# EAGLE design power board (EAGLE 5.07)
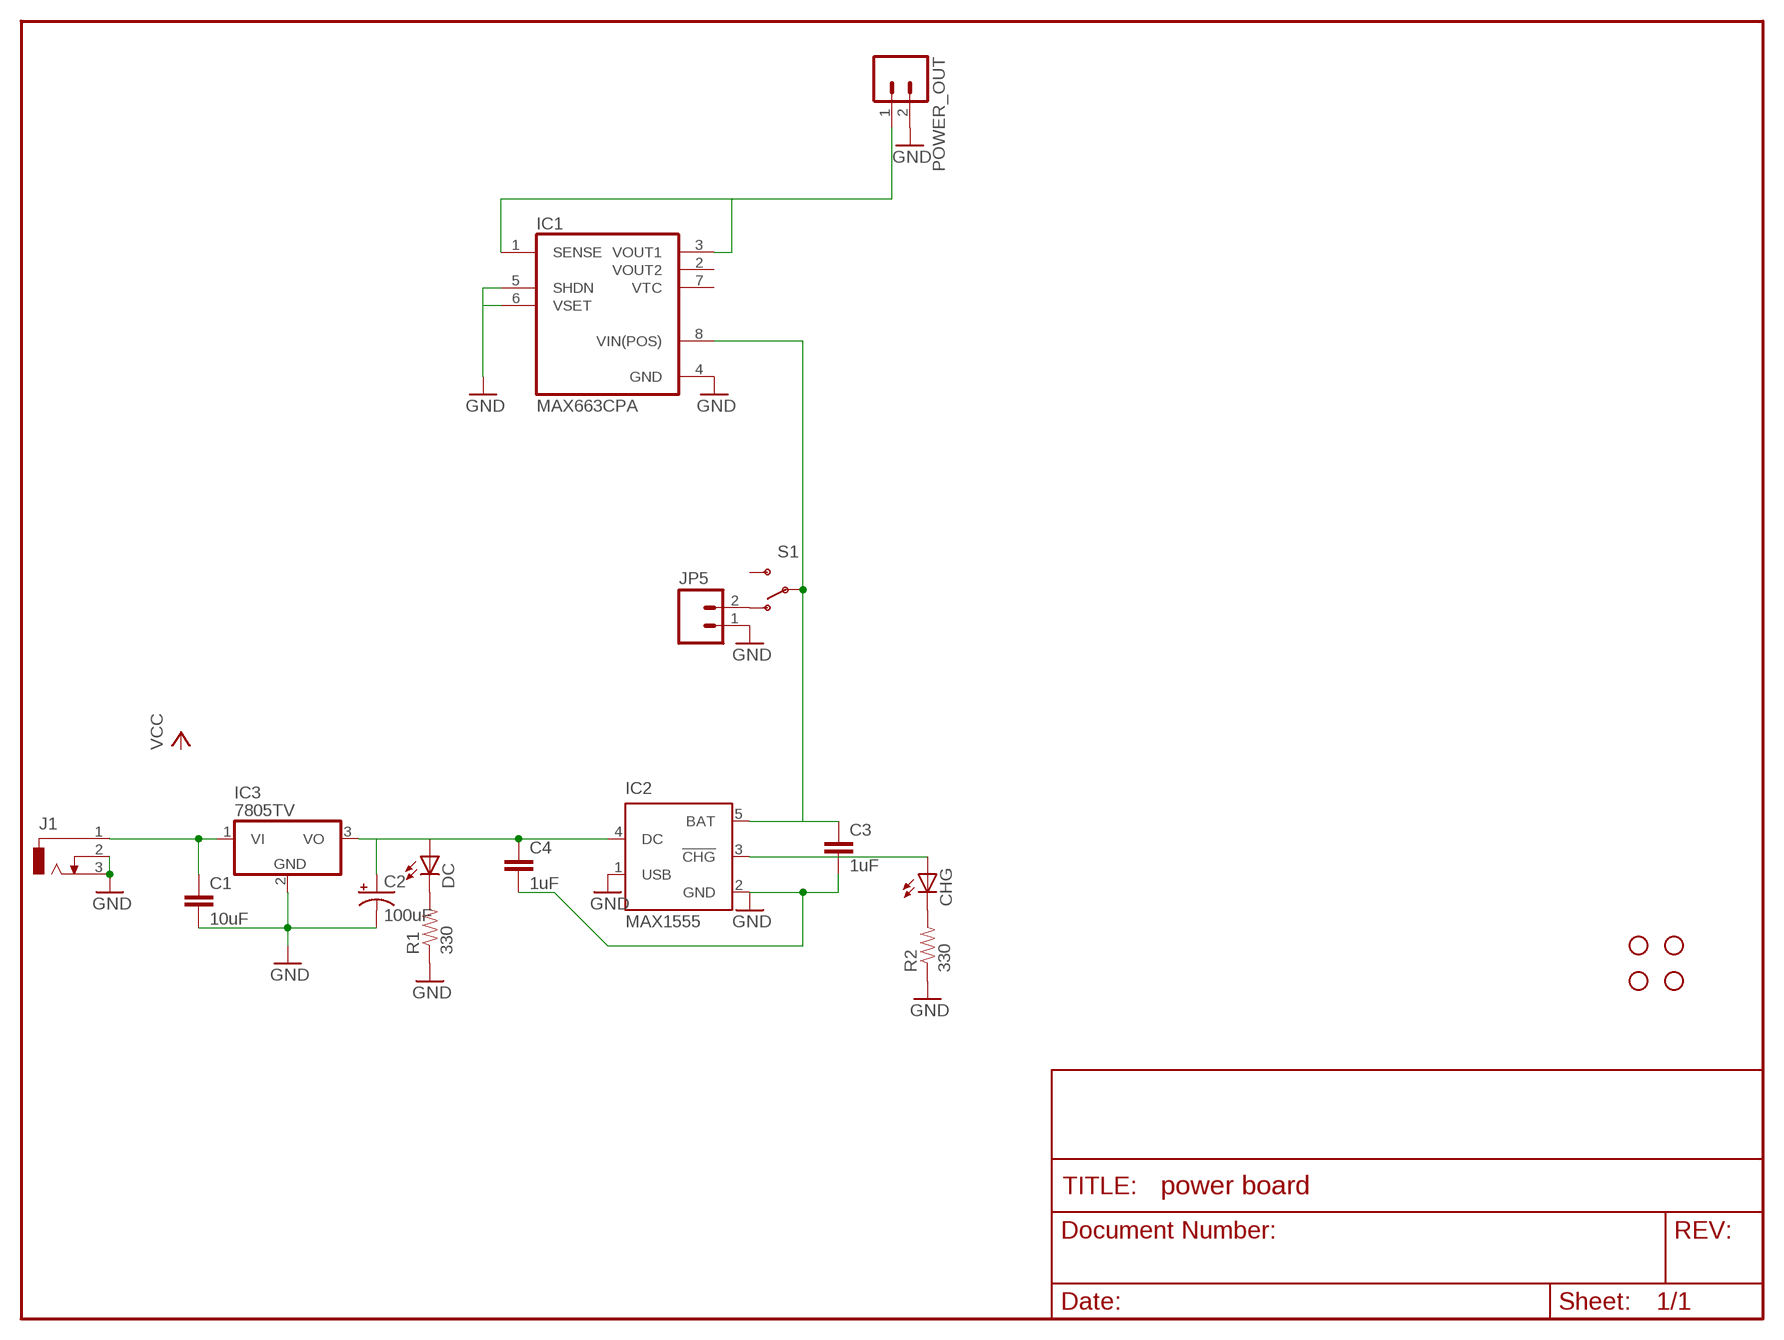
[diagram p0: schematic, sheet 1]

## Parts
C1  10uF  CAPPTH1  [CAP-PTH-5MM]
C2  100uF  CAP_POLPTH1  [CPOL-RADIAL-100UF-25V]
C3  1uF  CAPPTH1  [CAP-PTH-5MM]
C4  1uF  CAPPTH1  [CAP-PTH-5MM]
CHG  LED3MM  [LED3MM]
DC  LED3MM  [LED3MM]
IC1  MAX663CPA  [DIL08]
IC2  MAX1555  [SOT23-5L]
IC3  7805TV  [TO220V]
J1  DCJ0303  [DCJ0303]
JP1  STAND-OFFTIGHT  [STAND-OFF-TIGHT]
JP2  STAND-OFFTIGHT  [STAND-OFF-TIGHT]
JP3  STAND-OFFTIGHT  [STAND-OFF-TIGHT]
JP4  STAND-OFFTIGHT  [STAND-OFF-TIGHT]
JP5  M02-JST-2MM-SMT  [S2B-PH]
POWER_OUT  M02LOCK  [1X02_LOCK]
R1  330  RESISTORPTH1  [AXIAL-0.3]
R2  330  RESISTORPTH1  [AXIAL-0.3]
S1  SWITCH-SPSTPTH  [SWITCH-SPDT]

## Nets
GND: C1.2 C2.2(-) C3.2 C4.2 IC1.4(GND) IC1.5(SHDN) IC1.6(VSET) IC2.1(USB) IC2.2(GND) IC3.2(GND) J1.2 J1.3 JP5.1 POWER_OUT.2 R1.P$1 R2.P$1
N$1: JP5.2 S1.1(O)
N$2: C1.1 IC3.1(VI) J1.1
N$3: IC1.1(SENSE) IC1.3(VOUT1) POWER_OUT.1
N$4: C2.1(+) C4.1 DC.A IC2.4(DC) IC3.3(VO)
N$5: C3.1 IC1.8(VIN(POS)) IC2.5(BAT) S1.2(P)
N$6: DC.K(C) R1.P$2
N$7: CHG.K(C) R2.P$2
N$8: CHG.A IC2.3(!CHG)
Unconnected: IC1.2(VOUT2) IC1.7(VTC) S1.3(S)

## Library data of the parts
C1 C3 C4 = SparkFun:CAP: Capacitor Standard 0603 ceramic capacitor, and 0.1" leaded capacitor.
C2 = SparkFun:CAP_POL: Capacitor Polarized These are standard SMD and PTH capacitors. Normally 10uF, 47uF, and 100uF in electrolytic and tantalum varieties. Always verify the external diameter of the through hole cap, it varies with capacity, voltage, and manufacturer. The EIA devices should be standard.
CHG DC = led:LED: LED OSRAM: - CHIPLED LG R971, LG N971, LY N971, LG Q971, LY Q971, LO R971, LY R971 LH N974, LH R974 LS Q976, LO Q976, LY Q976 LO Q996 - Hyper CHIPLED LW Q18S LB Q993, LB Q99A, LB R99A - SideLED LS A670, LO A670, LY A670, LG A670, LP A670 LB A673, LV A673, LT A673, LW A673 LH A674 LY A675 LS A676, LA A676, LO A676, LY A676, LW A676 LS A679, LY A679, LG A679 - Hyper Micro SIDELED® LS Y876, LA Y876, LO Y876, LY Y876 LT Y87S - SmartLED LW L88C, LW L88S LB L89C, LB L89S, LG L890 LS L89K, LO L89K, LY L89K LS L896, LA L896, LO L896, LY L896 - TOPLED LS T670, LO T670, LY T670, LG T670, LP T670 LSG T670, LSP T670, LSY T670, LOP T670, LYG T670 LG T671, LOG T671, LSG T671 LB T673, LV T673, LT T673, LW T673 LH T674 LS T676, LA T676, LO T676, LY T676, LB T676, LH T676, LSB T676, LW T676 LB T67C, LV T67C, LT T67C, LS T67K, LO T67K, LY T67K, LW E67C LS E67B, LA E67B, LO E67B, LY E67B, LB E67C, LV E67C, LT E67C LW T67C LS T679, LY T679, LG T679 LS T770, LO T770, LY T770, LG T770, LP T770 LB T773, LV T773, LT T773, LW T773 LH T774 LS E675, LA E675, LY E675, LS T675 LS T776, LA T776, LO T776, LY T776, LB T776 LHGB T686 LT T68C, LB T68C - Hyper Mini TOPLED® LB M676 - Mini TOPLED Santana® LG M470 LS M47K, LO M47K, LY M47K Source: http://www.osram.convergy.de LUXEON: - LUMILED® LXK2-PW12-R00, LXK2-PW12-S00, LXK2-PW14-U00, LXK2-PW14-V00 LXK2-PM12-R00, LXK2-PM12-S00, LXK2-PM14-U00 LXK2-PE12-Q00, LXK2-PE12-R00, LXK2-PE12-S00, LXK2-PE14-T00, LXK2-PE14-U00 LXK2-PB12-K00, LXK2-PB12-L00, LXK2-PB12-M00, LXK2-PB14-N00, LXK2-PB14-P00, LXK2-PB14-Q00 LXK2-PR12-L00, LXK2-PR12-M00, LXK2-PR14-Q00, LXK2-PR14-R00 LXK2-PD12-Q00, LXK2-PD12-R00, LXK2-PD12-S00 LXK2-PH12-R00, LXK2-PH12-S00 LXK2-PL12-P00, LXK2-PL12-Q00, LXK2-PL12-R00 Source: www.luxeon.com KINGBRIGHT: KA-3528ASYC Source: www.kingbright.com
IC1 = maxim:MAX663CPA: Positive VOLTAGE REGULATOR
IC2 = maxim:MAX1555: Dual-Input USB/AC Adapter 1-Cell Li+ Battery Chargers Source: http://www.maxim-ic.com .. MAX1551-MAX1555.pdf
IC3 = linear:78*: Positive VOLTAGE REGULATOR Source: http://cache.national.com/ds/LM/LM78L05.pdf http://www.fairchildsemi.com/ds/LM/LM7805.pdf
J1 = con-jack:DCJ0303: DC POWER JACK Source: DCJ0303.pdf
JP1-JP4 = SparkFun:STAND-OFF: Stand Off This is the mechanical footprint for a #4 phillips button head screw. Use the keepout ring to avoid running the screw head into surrounding components. SKU : PRT-00447
JP5 POWER_OUT = SparkFun:M02: Header 2 Standard 2-pin 0.1" header. Use with straight break away headers (SKU : PRT-00116), right angle break away headers (PRT-00553), swiss pins (PRT-00743), machine pins (PRT-00117), and female headers (PRT-00115). Molex polarized connector foot print use with SKU : PRT-08233 with associated crimp pins and housings.
R1 R2 = SparkFun:RESISTOR: Resistor Basic schematic elements and footprints for 0603, 1206, and PTH 1/10th watt (small) resistors.
S1 = SparkFun:SWITCH-SPST: SPST Switch Simple slide switch. Spark Fun Electronics SKU : COM-00102

## Board
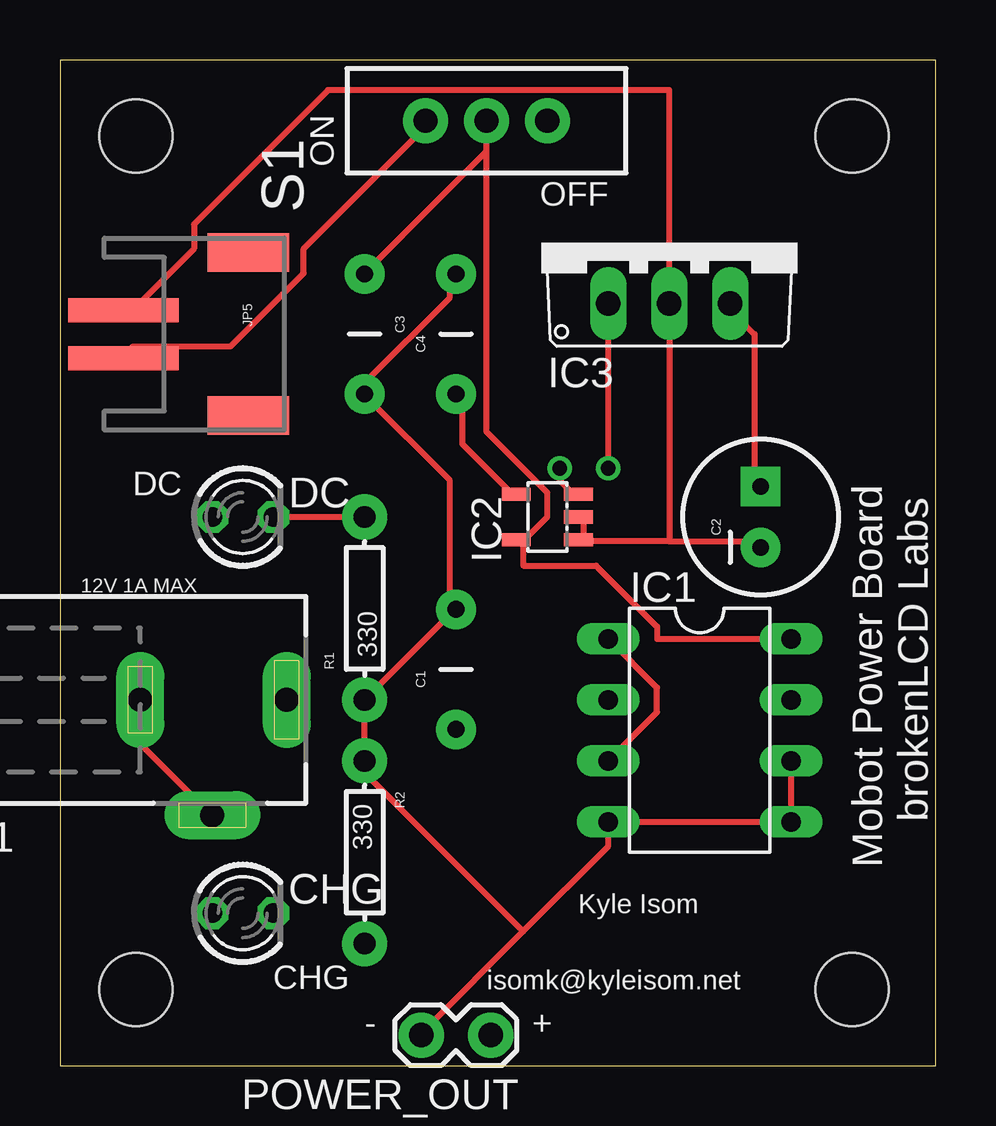
[diagram p1: board, top side]
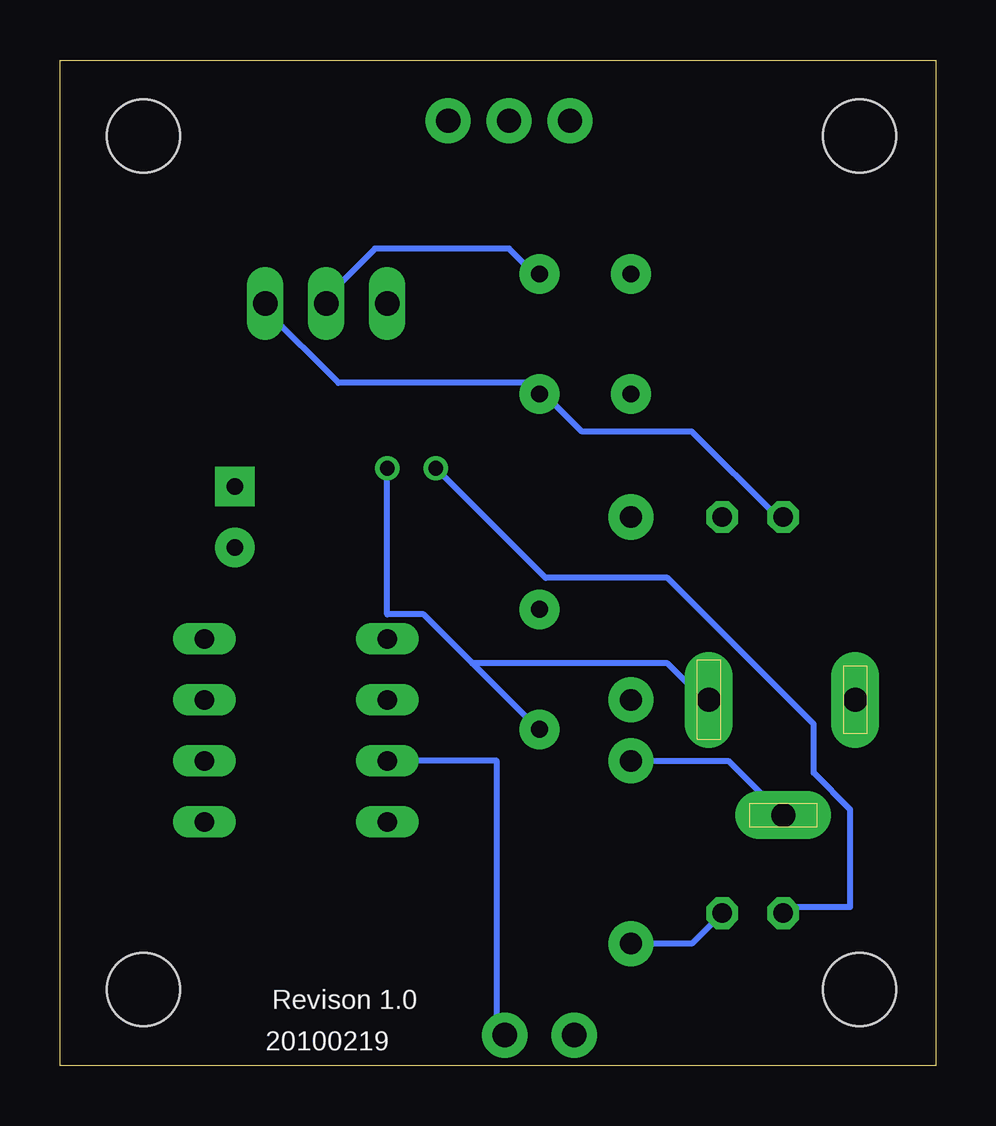
[diagram p2: board, bottom side, seen from below]

Size 36.5 x 41.9 mm. Coordinates in mm from the lower left corner, seen from the top.
Outline: 0,0 36.5,0 36.5,41.9 0,41.9 0,0
Copper layers (1*16): Top 0.035mm / dielectric 1.5mm / Bottom 0.035mm
Design rules "default": minimum track width 10mil, minimum drill 24mil, track to track 8mil, track to pad 8mil, pad to pad 8mil, via to via 8mil, smd to smd 8mil, copper to edge 40mil, drill to drill 8mil, minimum pad ring 10mil, minimum via ring 8mil, stop-mask expansion 4mil, vias tented up to drill 0mil, thermal gap 10mil

### Footprints (pad centres in the part's own frame; a part is rotated, then mirrored left to right if it is on the bottom)
CAP-PTH-5MM = drill 0.7 pad 1.651 round: 1 -2.5,0; 2 2.5,0
CPOL-RADIAL-100UF-25V = drill 0.7 pad 1.651 square: 1 1.27,0 | drill 0.7 pad 1.651 round: 2 -1.27,0
LED3MM = drill 0.813 octagon: A -1.27,0; K 1.27,0
DIL08 = drill 0.813 long: 1 -3.81,-3.81; 2 -1.27,-3.81; 3 1.27,-3.81; 4 3.81,-3.81; 5 3.81,3.81; 6 1.27,3.81; 7 -1.27,3.81; 8 -3.81,3.81
SOT23-5L = smd 0.55 x 1.2: 1 -0.95,-1.3; 2 0,-1.3; 3 0.95,-1.3; 4 0.95,1.3; 5 -0.95,1.3
TO220V = drill 1.016 long: 1 -2.54,-2.54; 2 0,-2.54; 3 2.54,-2.54
DCJ0303 = drill 1 pad 2 long: 1 0,3.1; 2 4.8,0; 3 0,-3
STAND-OFF-TIGHT = hole 3.048: 0,0
S2B-PH = smd 1 x 4.6: 1 -1,-3.7; 2 1,-3.7 | smd 1.6 x 3.4: NC1 -3.4,1.5; NC2 3.4,1.5
1X02_LOCK = drill 1.016 pad 1.88 round: 1 -0.178,0; 2 2.718,0
AXIAL-0.3 = drill 0.9 pad 1.88 round: P$1 -3.81,0; P$2 3.81,0
SWITCH-SPDT = drill 1.016 pad 1.88 round: 1 0,2.54; 2 0,0; 3 0,-2.54

### Placement (x,y rotation side)
C1  16.51,16.51 90 top
C2  29.21,22.86 90 top
C3  12.7,30.48 270 top
C4  16.51,30.48 90 top
CHG  7.62,6.35 0 top
DC  7.62,22.86 0 top
IC1  26.67,13.97 270 top
IC2  20.32,22.86 90 top
IC3  25.4,34.29 0 top
J1  6.35,15.24 270 top
JP1  33.02,38.73 0 top
JP2  33.02,3.17 0 top
JP3  3.17,38.73 0 top
JP4  3.17,3.17 0 top
JP5  6.35,30.48 270 top
POWER_OUT  17.78,1.27 180 top
R1  12.7,19.05 90 top
R2  12.7,8.89 270 top
S1  17.78,39.37 90 top

### Tracks (layer width: path | path; a pad name or v marks a point on that pad's centre or on a via)
GND
  Top 0.254: 21.84,21.84 21.84,22.86 IC2.2 | 25.4,21.84 28.96,21.84 C2.2 | 25.4,21.84 21.84,21.84 | 21.84,21.84 IC2.1 | 25.4,21.84 IC3.2 25.4,40.64 11.18,40.64 5.59,35.05 5.59,34.04 3.05,31.5 JP5.1 | IC1.6 IC1.5 IC1.4 22.86,9.14 19.3,5.59 | 19.3,5.59 15.24,1.52 POWER_OUT.2 | J1.2 6.1,10.67 3.56,13.21 3.56,15.24 J1.3 | C4.2 16.26,32.51 16.26,32 12.7,28.45 C3.2 12.7,27.94 16.26,24.38 16.26,19.3 C1.2 16.26,18.8 R1.P$1 R2.P$1 12.7,12.19 19.3,5.59
  Bottom 0.254: R2.P$1 8.64,12.7 6.6,10.67 J1.2 | IC3.2 25.4,32 23.37,34.04 17.78,34.04 16.76,33.02 C4.2
N$1
  Top 0.254: S1.1 15.24,39.12 10.16,34.04 10.16,33.02 7.11,29.97 3.05,29.97 JP5.2
N$2  (via drill 0.61)
  Top 0.254: v22.86,24.89 IC3.1
  Bottom 0.254: v22.86,24.89 22.86,18.8 21.34,18.8 19.3,16.76 | 19.3,16.76 16.76,14.22 C1.1 | 19.3,16.76 11.18,16.76 9.65,15.24 J1.1
N$3
  Top 0.254: IC1.3 24.89,14.73 24.89,15.75 IC1.1
  Bottom 0.254: IC1.3 18.29,12.7 18.29,1.52 POWER_OUT.1
N$4
  Top 0.254: IC3.3 27.94,31.5 28.96,30.48 28.96,24.38 C2.1 | IC2.4 18.8,23.88 16.76,25.91 16.76,27.94 C4.1
  Bottom 0.254: DC.A 6.6,22.86 10.16,26.42 14.73,26.42 16.26,27.94 C4.1 16.76,28.45 24.89,28.45 27.94,31.5 IC3.3
N$5
  Top 0.254: 19.3,21.84 20.32,22.86 20.32,23.88 17.78,26.42 17.78,38.1 | 17.78,38.1 S1.2 | IC1.8 24.89,17.78 24.89,18.29 22.35,20.83 19.3,20.83 19.3,21.84 | IC2.5 19.3,21.84 | 17.78,38.1 12.7,33.02 C3.1
N$6
  Top 0.254: DC.K R1.P$2
N$7
  Bottom 0.254: R2.P$2 10.16,5.08 CHG.K
N$8  (via drill 0.61)
  Top 0.254: v20.83,24.89 20.83,24.38 21.34,23.88 IC2.3
  Bottom 0.254: v20.83,24.89 16.26,20.32 11.18,20.32 5.08,14.22 5.08,12.19 3.56,10.67 3.56,6.6 6.1,6.6 CHG.A

### Text on the board
tPlace: ON | OFF | DC | 12V 1A MAX | brokenLCD Labs | Mobot Power Board | Kyle Isom | CHG | isomk@kyleisom.net | - | +
bPlace: Revison 1.0 | 20100219